# Altium schematic sheet CPU_top.SchDoc
size A3; SheetNumber: 1; SheetTotal: 5
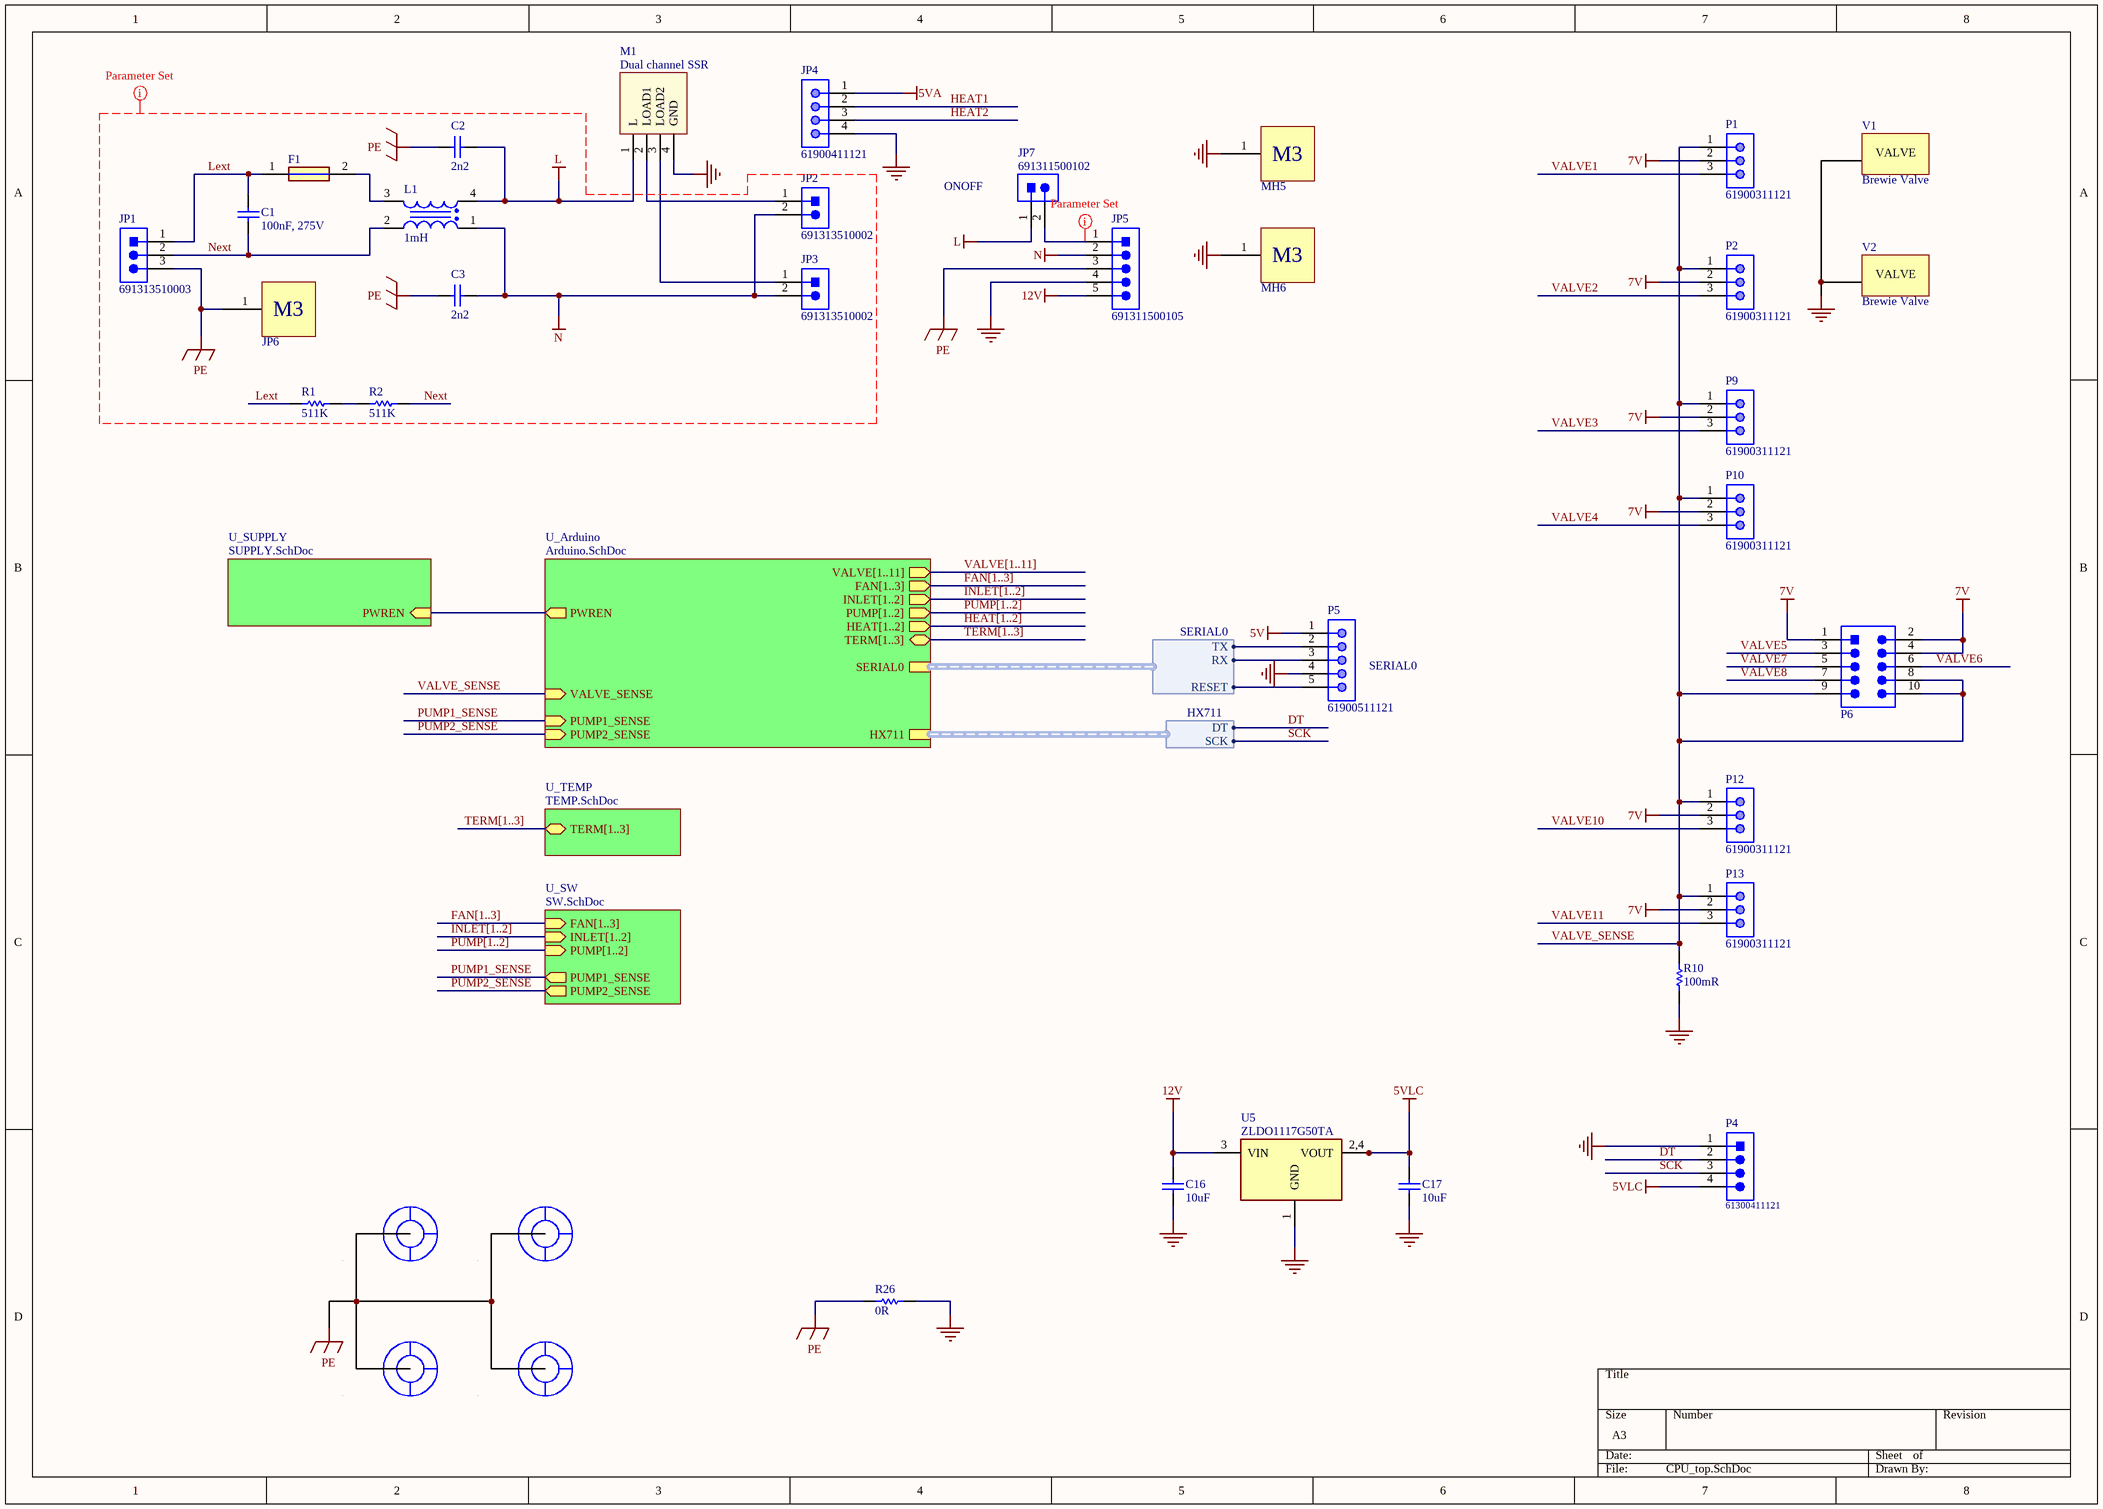
[diagram p0: CPU_top.SchDoc]

## Parts
C1  100nF, 275V  [WCAP-FTX2_L13W7H13]
C2  value 2n2  [CAP CERDISC 9x5.5 P10 H13.0 (IPC RoHS)]  (hidden comment: CAP)
C3  value 2n2  [CAP CERDISC 9x5.5 P10 H13.0 (IPC RoHS)]  (hidden comment: CAP)
C16  value 10uF  [CAP_0805_H145 (_IPC_HD)]  (hidden comment: 10uF 0805)
C17  value 10uF  [CAP_0805_H145 (_IPC_HD)]  (hidden comment: 10uF 0805)
F1  SF-3812F1500T-2  [SF3812F1500T2]  (value not drawn)
JP1  691313510003  [691313510003]
JP2  691313510002  [691313510002]
JP3  691313510002  [691313510002]
JP4  61900411121  [61900411121]
JP5  691311500105  [691311500105]
JP6  Adafruit Standoff 6mm  [7466003]  (value not drawn)
JP7  691311500102  [691311500102]
L1  1mH  [744834101]
M1  Dual channel SSR  [SSR]
MH1  Mounting hole  [MECH_MHOLE_3.5-GND-2]  (value not drawn)  (no BOM)
MH2  Mounting hole  [MECH_MHOLE_3.5-GND-2]  (value not drawn)  (no BOM)
MH3  Mounting hole  [MECH_MHOLE_3.5-GND-2]  (value not drawn)  (no BOM)
MH4  Mounting hole  [MECH_MHOLE_3.5-GND-2]  (value not drawn)  (no BOM)
MH5  Adafruit Standoff 6mm  [7466003]  (value not drawn)
MH6  Adafruit Standoff 6mm  [7466003]  (value not drawn)
P1  61900311121  [61900311121]
P2  61900311121  [61900311121]
P4  61300411121  [61300411121]
P5  61900511121  [61900511121]
P6  61201021621  [61201021621]  (value not drawn)
P9  61900311121  [61900311121]
P10  61900311121  [61900311121]
P12  61900311121  [61900311121]
P13  61900311121  [61900311121]
R1  value 511K  [RES_1206_H060 (_IPC_MD)]  (hidden comment: 511K 1% 0,25W 200V 1206)
R2  value 511K  [RES_1206_H060 (_IPC_MD)]  (hidden comment: 511K 1% 0,25W 200V 1206)
R10  value 100mR  [RES_1206_H060 (_IPC_MD)]  (hidden comment: 100mR 1% 0,25W 200V 1206)
R26  value 0R  [RES_1206_H060 (_IPC_MD)]  (hidden comment: JUMPER)
U5  ZLDO1117G50TA  [SOT230P700X180-4N]
V1  Brewie Valve  [Valve2]
V2  Brewie Valve  [Valve2]

## Sub-sheets
U_Arduino = Arduino.SchDoc: VALVE[1..11] (out), FAN[1..3] (out), INLET[1..2] (out), PUMP[1..2] (out), HEAT[1..2] (out), PWREN (out), TERM[1..3] (bidir), SERIAL0 (harness SERIAL0), HX711 (harness HX711), VALVE_SENSE (in), PUMP1_SENSE (in), PUMP2_SENSE (in)
U_SUPPLY = SUPPLY.SchDoc: PWREN (in)
U_SW = SW.SchDoc: FAN[1..3] (in), INLET[1..2] (in), PUMP2_SENSE (out), PUMP1_SENSE (out), PUMP[1..2] (in)
U_TEMP = TEMP.SchDoc: TERM[1..3] (bidir)

## Harnesses
SERIAL0: TX, RX, RESET
HX711: DT, SCK

## Nets
5V: P5.1
5VA: JP4.1
5VLC: C17.2 P4.4 U5.2(VOUT_1) U5.4(VOUT)
7V: P1.2 P2.2 P6.1 P6.2 P6.4 P9.2 P10.2 P12.2 P13.2
12V: C16.2 JP5.5 U5.3(VIN)
GND: C16.1 C17.1 JP4.4 JP5.4 M1.4(GND) MH5.1 MH6.1 P4.1 P5.4 R10.1 R26.2 U5.1(GND) V1.1(CONN) V2.1(CONN)
L: C2.2 JP7.1 L1.4 M1.1(L)
N: C3.2 JP2.2 JP3.2 JP5.2 L1.1
PE: C2.1 C3.1 JP1.3 JP5.3 JP6.1 MH1.1(NET) MH2.1(NET) MH3.1(NET) MH4.1(NET) R26.1
DT: P4.2 ; sheet U_Arduino/HX711.DT
HEAT1: JP4.2
HEAT2: JP4.3
Lext: C1.2 F1.1 JP1.1 R1.1
Next: C1.1 JP1.2 L1.2 R2.2
PUMP1_SENSE: sheet U_Arduino/PUMP1_SENSE, sheet U_SW/PUMP1_SENSE
PUMP2_SENSE: sheet U_Arduino/PUMP2_SENSE, sheet U_SW/PUMP2_SENSE
SCK: P4.3 ; sheet U_Arduino/HX711.SCK
VALVE1: P1.3
VALVE2: P2.3
VALVE3: P9.3
VALVE4: P10.3
VALVE5: P6.3
VALVE6: P6.6
VALVE7: P6.5
VALVE8: P6.7
VALVE10: P12.3
VALVE11: P13.3
VALVE_SENSE: P1.1 P2.1 P6.8 P6.9 P6.10 P9.1 P10.1 P12.1 P13.1 R10.2 ; sheet U_Arduino/VALVE_SENSE
NetF1_2: F1.2 L1.3
NetJP2_1: JP2.1 M1.2(LOAD1)
NetJP3_1: JP3.1 M1.3(LOAD2)
NetJP5_1: JP5.1 JP7.2
NetP5_2: P5.2 ; sheet U_Arduino/SERIAL0.TX
NetP5_3: P5.3 ; sheet U_Arduino/SERIAL0.RX
NetP5_5: P5.5 ; sheet U_Arduino/SERIAL0.RESET
NetR1_2: R1.2 R2.1
(unnamed): sheet U_SUPPLY/PWREN, sheet U_Arduino/PWREN

## Buses and harness runs
bus FAN[1..3] = sheet U_Arduino/FAN[1..3]
bus FAN[1..3] = sheet U_SW/FAN[1..3]
bus HEAT[1..2] = sheet U_Arduino/HEAT[1..2]
bus INLET[1..2] = sheet U_Arduino/INLET[1..2]
bus INLET[1..2] = sheet U_SW/INLET[1..2]
bus PUMP[1..2] = sheet U_Arduino/PUMP[1..2]
bus PUMP[1..2] = sheet U_SW/PUMP[1..2]
bus TERM[1..3] = sheet U_Arduino/TERM[1..3]
bus TERM[1..3] = sheet U_TEMP/TERM[1..3]
bus VALVE[1..11] = sheet U_Arduino/VALVE[1..11]

## Layout directives
net class HV: L, Lext, N, NetJP5_1, Next, PE

## Notes on the sheet
- ONOFF
- (near P5) SERIAL0
- (in symbol CONNM3) M3
- (in symbol Valve) VALVE
- (in symbol ZLDO1117G50TA) 2,4

## Library data of the parts
C1 = 890324023023: WCAP-FTX2 Film Capacitor, THT, L13W7H13, 100nF, 275V; Manufacturer: Wurth Elektronik; Insulation Resistance: 30000MOhm; Dissipation Factor@100kHz: 0.5%; Dissipation Factor@1kHz: 0.1%; Rated Voltage: 275VAC; Rate of Voltage Rise: 300V/us; Pitch: 10mm; Technical Reference: MX2P010104K275ASPB16000; Capacitance Tolerance: +/-10%; ComponentLink1Description: Manufacturer; ComponentLink1URL: http://www.we-online.de; ComponentLink2Description: Datasheet; ComponentLink2URL: https://www.we-online.com/catalog/datasheet/890324023023.pdf; Length: 13mm; Mounting Technology: THT; Operating Temperature: -40 to +105degC; Manufacturer Part Number: 890324023023; Width: 7mm; Capacitance: 100nF; Dissipation Factor@10kHz: 0.1%; Height: 13mm; Packaging: Carton; Published Date: May 2020
C2 C3 = 2235-0004: Cap X1Y1 2n2 400Vac 20% Y5V 4M E; Component: C921U222MVVDBA7317; Type: Standard; Designator: C; Curr: Typ X1/Y1; PCB Lib: EEPAB Hole mount.PcbLib; Scm Lib: Discrete.SchLib; Check: N; Create: Urband; Part Number: 2235-0004; EEPAB Prt Nr: 2235-0004; Volt: 400Vac; Tol: 20%; Qty: 1; Temp: E; PCB Footprint: CAP CERDISC 9x5.5 P10 H13.0 (IPC RoHS); Scm Symbol: CAP; Mfg Part Nr: C921U222MVVDBA7317; Supplier 1: Arrow; Supplier Part Number 1: C921U222MVVDBA7317; Supplier 2: Avnet; Supplier 3: Digi-Key; Supplier Part Number 3: 399-9487-1-ND; Supplier 4: Distrelec; Supplier 5: Farnell; Supplier Part Number 5: 2440214; Supplier 6: Future Electronics; Supplier 7: Mouser; Supplier Part Number 7: 80-C921U222MVVDBAP; Supplier 8: RSComponents; Supplier 9: Rutronik; Supplier 10: TTI
C16 C17 = 0805YD106KAT2A: CAP CER 10UF 16V X5R 0805; Type: Standard; Designator: C?; PCB Lib: MUAB_CAP.PcbLib; Scm Lib: Discrete.SchLib; Tol: 10%; Volt: 16V; Part Number: 0805YD106KAT2A; Dielec: X5R; Qty: 1; Supplier 1: Arrow; Supplier 2: Avnet; Supplier 3: Digi-Key; Supplier Part Number 3: 478-5165-1-ND; Supplier 4: Distrelec; Supplier 5: Farnell; Supplier 6: Future Electronics; Supplier 7: Mouser; Supplier Part Number 7: 581-0805YD106K; Supplier 8: RSComponents; Supplier 9: Rutronik; Supplier 10: SEED OPL
F1 = SF-3812F1500T-2: Fuse; Manufacturer_Name: Bourns; Datasheet Link: https://componentsearchengine.com//SF-3812F1500T-2.pdf; Height: 3.3mm; Manufacturer_Part_Number: SF-3812F1500T-2; Mouser Part Number: 652-SF-3812F1500T-2; Mouser Price/Stock: https://www.mouser.co.uk/ProductDetail/Bourns/SF-3812F1500T-2?qs=vLWxofP3U2y%252BowuZb8%2FTgg%3D%3D
JP1 = 691313510003: WR-TBL Serie 313 Close Horizontal PCB Header, Pluggable, THT, pitch 5.08mm, 3p; Manufacturer: Wurth Elektronik; Modularity: No; Pin Number: 3; Rated Current [UL]: 20A; Working Voltage [UL]: 300VAC; ComponentLink1Description: Manufacturer; ComponentLink1URL: http://www.we-online.de; ComponentLink2URL: https://katalog.we-online.de/em/datasheet/691313510003.pdf; ComponentLink2Description: Datasheet; Mounting Technology: THT; Manufacturer Part Number: 691313510003; Packaging: Box; Operating Temperature: -40 to +105degC; PCB/Cable/Panel: PCB; Pitch: 5.08mm; Published Date: Feburary 2021; Type: Horizontal; Application: Pluggable
JP2 JP3 = 691313510002: WR-TBL Serie 313 Close Horizontal PCB Header, Pluggable, THT, pitch 5.08mm, 2p; Manufacturer: Wurth Elektronik; Modularity: No; Pin Number: 2; Rated Current [UL]: 20A; Working Voltage [UL]: 300VAC; ComponentLink1Description: Manufacturer; ComponentLink1URL: http://www.we-online.de; ComponentLink2URL: https://katalog.we-online.de/em/datasheet/691313510002.pdf; ComponentLink2Description: Datasheet; Mounting Technology: THT; Manufacturer Part Number: 691313510002; Packaging: Box; Operating Temperature: -40 to +105degC; PCB/Cable/Panel: PCB; Pitch: 5.08mm; Published Date: Feburary 2021; Type: Horizontal; Application: Pluggable
JP4 = 61900411121: WR-WTB THT Male Vertical Locking Header, pitch 2.54mm, 4p; Pin Number: 4; Contact Resistance: 20mOhm; Rated Current: 3A; Withstanding Voltage: 1000VAC; Working Voltage: 250VAC; ComponentLink1Description: Manufacturer; ComponentLink1URL: http://www.we-online.de; ComponentLink2Description: Datasheet; ComponentLink2URL: https://www.we-online.com/catalog/datasheet/61900411121.pdf; Pitch: 2.54mm; Published Date: January 2020; Publisher: Wurth Elektronik; Mounting Technology: THT; Packaging: Bag; Operating Temperature: -40 to +105degC; Part Number: 61900411121; Gender: Male; Type: Vertical
JP5 = 691311500105: WR-TBL Serie 311 Close Vertical PCB Header, Pluggable, THT, pitch 5.08mm, 5p; Manufacturer: Wurth Elektronik; Modularity: No; Pin Number: 5; Rated Current [UL]: 20A; Working Voltage [UL]: 300VAC; ComponentLink1Description: Manufacturer; ComponentLink1URL: http://www.we-online.de; ComponentLink2URL: https://katalog.we-online.de/em/datasheet/691311500105.pdf; ComponentLink2Description: Datasheet; Mounting Technology: THT; Manufacturer Part Number: 691311500105; Packaging: Box; Operating Temperature: -40 to +105degC; PCB/Cable/Panel: PCB; Pitch: 5.08mm; Published Date: Feburary 2021; Type: Vertical; Application: Pluggable
JP6 MH5 MH6 = CONNM3: Manufacturer: Adafruit; Height: 6mm
JP7 = 691311500102: WR-TBL Serie 311 Close Vertical PCB Header, Pluggable, THT, pitch 5.08mm, 2p; Manufacturer: Wurth Elektronik; Modularity: No; Pin Number: 2; Rated Current [UL]: 20A; Working Voltage [UL]: 300VAC; ComponentLink1Description: Manufacturer; ComponentLink1URL: http://www.we-online.de; ComponentLink2URL: https://katalog.we-online.de/em/datasheet/691311500102.pdf; ComponentLink2Description: Datasheet; Mounting Technology: THT; Manufacturer Part Number: 691311500102; Packaging: Box; Operating Temperature: -40 to +105degC; PCB/Cable/Panel: PCB; Pitch: 5.08mm; Published Date: Feburary 2021; Type: Vertical; Application: Pluggable
L1 = 744834101: WE-CMBH Common Mode Power Line Choke, Type L, 1mH; Manufacturer: Wurth Elektronik; Rated Current: 10A; DC Resistance max.: 12.5mOhm; Insulation Test Voltage: 1500VAC; Rated Voltage: 250VAC; ComponentLink1Description: Manufacturer; ComponentLink1URL: http://www.we-online.de; ComponentLink2Description: Datasheet; ComponentLink2URL: https://www.we-online.com/catalog/datasheet/744834101.pdf; Manufacturer Part Number: 744834101; Published Date: April 2020; Inductance: 1mH; Operating Temperature: -40 to +125degC; Mounting Technology: THT; Packaging: Tray; Size: Type L
M1 = SSR
MH1-MH4 = MECH_MHOLE_NET
P1 P2 P9 P10 P12 P13 = 61900311121: WR-WTB THT Male Vertical Locking Header, pitch 2.54mm, 3p; Pin Number: 3; Contact Resistance: 20mOhm; Rated Current: 3A; Withstanding Voltage: 1000VAC; Working Voltage: 250VAC; ComponentLink1Description: Manufacturer; ComponentLink1URL: http://www.we-online.de; ComponentLink2Description: Datasheet; ComponentLink2URL: https://www.we-online.com/catalog/datasheet/61900311121.pdf; Pitch: 2.54mm; Published Date: January 2020; Publisher: Wurth Elektronik; Mounting Technology: THT; Packaging: Bag; Operating Temperature: -40 to +105degC; Part Number: 61900311121; Gender: Male; Type: Vertical
P4 = 61300411121: WR-PHD Pin Header, THT, pitch 2.54mm, Single Row, Vertical, 4p; Manufacturer: Wurth Elektronik; Pin Number: 4; Rated Current: 3A; Working Voltage: 250VAC; Withstanding Voltage: 500VAC; Contact Resistance: 20mOhm; ComponentLink1Description: Manufacturer; ComponentLink1URL: http://www.we-online.de; ComponentLink2Description: Datasheet; ComponentLink2URL: https://www.we-online.com/catalog/datasheet/61300411121.pdf; Manufacturer Part Number: 61300411121; Pitch: 2.54mm; Operating Temperature: -40 to +105degC; Mounting Technology: THT; Packaging: Bag; Gender: Pin Header; Row Number: Single; Orientation: Vertical
P5 = 61900511121: WR-WTB THT Male Vertical Locking Header, pitch 2.54mm, 5p; Pin Number: 5; Contact Resistance: 20mOhm; Rated Current: 3A; Withstanding Voltage: 1000VAC; Working Voltage: 250VAC; ComponentLink1Description: Manufacturer; ComponentLink1URL: http://www.we-online.de; ComponentLink2Description: Datasheet; ComponentLink2URL: https://www.we-online.com/catalog/datasheet/61900511121.pdf; Pitch: 2.54mm; Published Date: January 2020; Publisher: Wurth Elektronik; Mounting Technology: THT; Packaging: Bag; Operating Temperature: -40 to +105degC; Part Number: 61900511121; Gender: Male; Type: Vertical
P6 = 61201021621: WR-BHD Box Header, Male, pitch 2.54mm, THT, Straight, 10p; Manufacturer: Wurth Elektronik; Contact Resistance: 20mOhm; Insulation Resistance: 1000MOhm; Number of Positions: 10; Rated Current: 3A; Withstanding Voltage: 500V; Working Voltage: 250V; ComponentLink1Description: Manufacturer Link; ComponentLink1URL: http://www.we-online.de; ComponentLink2Description: Datasheet; ComponentLink2URL: https://www.we-online.com/catalog/datasheet/61201021621.pdf; Gender: Male; Height: 9.1mm; Length: 20.36mm; Manufacturer Part Number: 61201021621; Mounting Technology: THT; Number of Rows: 2; Operating Temperature max.: 105C; Operating Temperature min.: -40C; Orientation: Straight; Packaging: Tray; Pitch: 2.54mm; Width: 9.1mm
R1 R2 = RES511K1%1206: Designator: R; PCB Lib: MUAB_RES.PcbLib; Scm Lib: Discrete.SchLib; Watt: 0,25W; Tol: 1%; Part Number: RES511K1%1206; Type: Standard; Volt: 200V; Qty: 1; Supplier 1: Arrow; Supplier 2: Avnet; Supplier 3: Digi-Key; Supplier 4: Distrelec; Supplier 5: Farnell; Supplier 6: Future Electronics; Supplier 7: Mouser; Supplier 8: RSComponents; Supplier 9: Rutronik; Supplier 10: SEED OPL
R10 = RES100mR1%1206: Designator: R; PCB Lib: MUAB_RES.PcbLib; Scm Lib: Discrete.SchLib; Watt: 0,25W; Tol: 1%; Part Number: RES100mR1%1206; Type: Standard; Volt: 200V; Qty: 1; Supplier 1: Arrow; Supplier 2: Avnet; Supplier 3: Digi-Key; Supplier 4: Distrelec; Supplier 5: Farnell; Supplier 6: Future Electronics; Supplier 7: Mouser; Supplier 8: RSComponents; Supplier 9: Rutronik; Supplier 10: SEED OPL
R26 = JUMPER1206: Tol: 1%; Designator: R; PCB Lib: MUAB_RES.PcbLib; Scm Lib: Discrete.SchLib; Volt: 200V; Watt: 0,25W; Part Number: JUMPER1206; Type: Standard; Qty: 1; Supplier 1: Arrow; Supplier 2: Avnet; Supplier 3: Digi-Key; Supplier 4: Distrelec; Supplier 5: Farnell; Supplier 6: Future Electronics; Supplier 7: Mouser; Supplier 8: RSComponents; Supplier 9: Rutronik; Supplier 10: SEED OPL
U5 = ZLDO1117G50TA: IC REG LINEAR 3.3V 1A SOT223; Manufacturer_Name: Diodes Inc.; Designator: U; Volt: 18V; Volt Out: 5.0V; Temp: I; Datasheet Link: https://datasheet.datasheetarchive.com/originals/distributors/Datasheets-DIO/DSADIO2000767.pdf; Height: 1.8mm; Manufacturer_Part_Number: ZLDO1117G33TA; Mouser Part Number: 522-ZLDO1117G33TA; Mouser Price/Stock: https://www.mouser.co.uk/ProductDetail/Diodes-Incorporated/ZLDO1117G33TA?qs=4YT44p7w2bvlytOS2j%2F0vw%3D%3D; Arrow Part Number: ZLDO1117G33TA; Arrow Price/Stock: https://www.arrow.com/en/products/zldo1117g33ta/diodes-incorporated?region=nac; Part Number: ZLDO1117G50TA; Component: ZLDO1117G50TA; Type: Standard; Curr: 1A; Qty: 1; Supplier 1: Arrow; Supplier 2: Avnet; Supplier 3: Digi-Key; Supplier Part Number 3: ZLDO1117G50DICT-ND; Supplier 4: Distrelec; Supplier 5: Farnell; Supplier 6: Future Electronics; Supplier 7: Mouser; Supplier Part Number 7: 522-ZLDO1117G50TA; Supplier 8: RSComponents; Supplier 9: Rutronik; Supplier 10: TTI
V1 V2 = Valve